# Altium schematic sheet 电子脚铐手持式主控板_Power.SchDoc
size A4
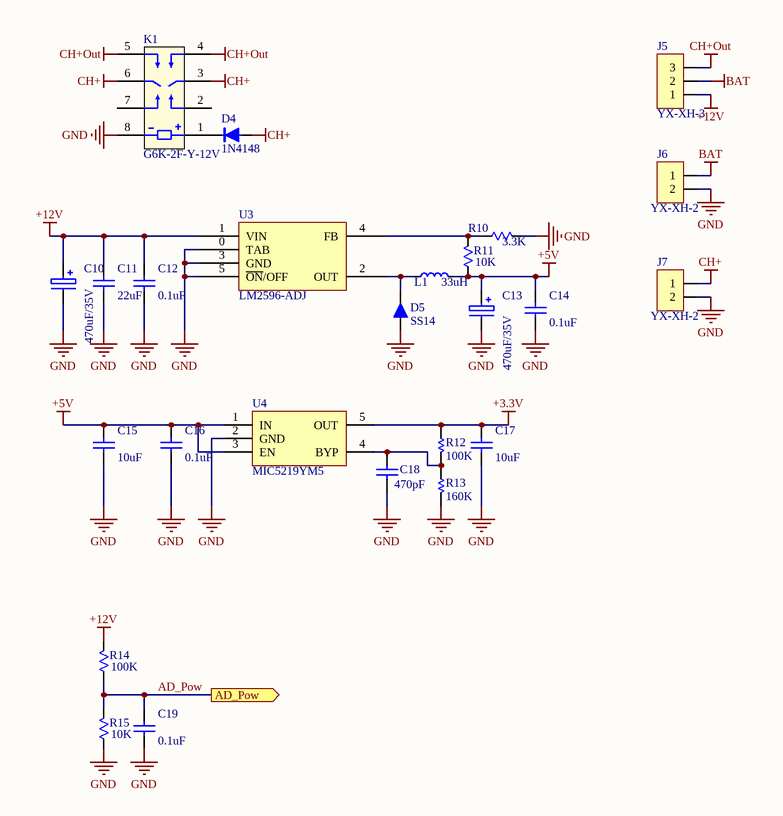
[diagram p0: 电子脚铐手持式主控板_Power.SchDoc]

## Parts
C10  470uF/35V  [C10*10.8]
C11  22uF  [C1210]
C12  0.1uF  [C0603]
C13  470uF/35V  [C10*10.8]
C14  0.1uF  [C0603]
C15  10uF  [C0603]
C16  0.1uF  [C0603]
C17  10uF  [C0603]
C18  470pF  [C0603]
C19  0.1uF  [C0603]
D4  1N4148  [SOD-80-S]
D5  SS14  [SMA]
J5  YX-XH-3  [YX-XH-3]
J6  YX-XH-2  [YX-XH-2]
J7  YX-XH-2  [YX-XH-2]
K1  G6K-2F-Y-12V  [G6K-2F-Y]
L1  33uH  [L10.5*11.5mm]
R10  3.3K  [R0603]
R11  10K  [R0603]
R12  100K  [R0603]
R13  160K  [R0603]
R14  100K  [R0603]
R15  10K  [R0603]
U3  LM2596-ADJ  [TO-263-5]
U4  MIC5219YM5  [SOT-23-5]

## Ports
AD_Pow (out)

## Nets
+3.3V: C17.1 R12.1 U4.5(OUT)
+5V: C13.1 C14.1 C15.1 C16.1 L1.2 R11.1 U4.1(IN) U4.3(EN)
+12V: C10.1 C11.1 C12.1 J5.1 R14.2 U3.1(VIN)
BAT: J5.2 J6.1
CH+: D4.1(A) J7.1 K1.3 K1.6
CH+Out: J5.3 K1.4 K1.5
GND: C10.2 C11.2 C12.2 C13.2 C14.2 C15.2 C16.2 C17.2 C18.2 C19.2 D5.1(A) J6.2 J7.2 K1.8 R10.2 R13.2 R15.1 U3.0(TAB) U3.3(GND) U3.5(~{ON}/OFF) U4.2(GND)
AD_Pow: C19.1 R14.1 R15.2 ; port AD_Pow
NetC18_1: C18.1 R12.2 R13.1 U4.4(BYP)
NetD4_2: D4.2(K) K1.1
NetD5_2: D5.2(K) L1.1 U3.2(OUT)
NetR10_1: R10.1 R11.2 U3.4(FB)

Not connected (* = marked no-connect by the designer): K1 2 7

## Notes on the sheet
- 文件名:
- 审核:
- 制图人:
- 孟浩
- 校对:
- 图号:
- 批准:
- 日期:

## Library data of the parts
C10 C13 = ELECTRO: Electrolytic Capacitor
C11 C12 C14-C19 = CAP: Published: 8-Jun-2000; LatestRevisionDate: 17-Jul-2002; LatestRevisionNote: Re-released for DXP Platform.; PackageReference: RAD-0.3; Publisher: Altium Limited
D4 = DIODE-SWITCHING: Silicon Epitaxial Planar Diodes
D5 = Diode 1N4148: High Conductance Fast Diode; Published: 8-Jun-2000; LatestRevisionDate: 17-Jul-2002; LatestRevisionNote: Re-released for DXP Platform.; DatasheetVersion: 1997; PackageReference: DO-35; Publisher: Altium Limited; PackageDescription: Diode, Axial; Body 3.8 x 1.9 mm (LxDia. max), Lead Dia. 0.53 mm (max); Code_JEDEC: DO-204-AH; ComponentLink1Description: Manufacturer Link; ComponentLink1URL: http://www.fairchildsemi.com/; ComponentLink2Description: Datasheet; ComponentLink2URL: http://www.fairchildsemi.com/ds/1N%2F1N4148.pdf
J5 = HEADER1X3
J6 J7 = Jack 1x2: 插座
K1 = G6K-2F-Y
L1 = INDUCTOR: Code_IEC: 1005; Published: 8-Jun-2000; LatestRevisionDate: 17-Jul-2002; LatestRevisionNote: Re-released for DXP Platform.; PackageReference: 0402-A; Publisher: Altium Limited; Code_JEITA: 0402
R10 R11 R14 R15 = RES: Resistor; Published: 8-Jun-2000; LatestRevisionDate: 17-Jul-2002; LatestRevisionNote: Re-released for DXP Platform.; PackageReference: AXIAL-0.3; Publisher: Altium Limited
R12 R13 = Res
U3 = LM25x6-5: LM2596-5;LM2576-5
U4 = MIC5205